# Altium schematic sheet Joysticks.SchDoc
size 149 x 110 mm; SheetNumber: 2; SheetTotal: 2
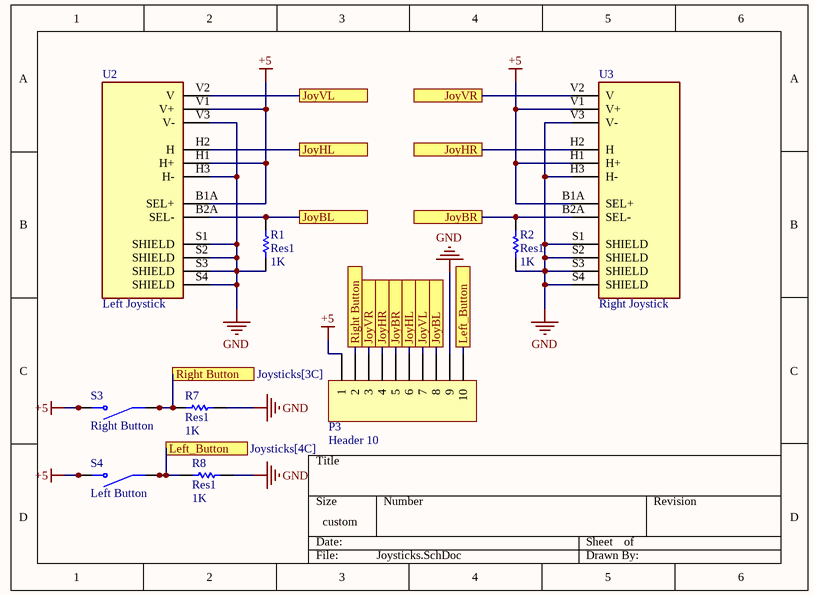
[diagram p0: Joysticks.SchDoc]

## Parts
P3  Header 10  [HDR1X10]
R1  Res1  value 1K  [AXIAL-0.3]
R2  Res1  value 1K  [AXIAL-0.3]
R7  Res1  value 1K  [AXIAL-0.3]
R8  Res1  value 1K  [AXIAL-0.3]
S3  Right Button  [SW_B3F-4055]
S4  Left Button  [SW_B3F-4055]
U2  Left Joystick  [XDCR_COM-09032]
U3  Right Joystick  [XDCR_COM-09032]

## Ports
JoyBL (see Joysticks[3B], Sheet1[3A]), JoyBL (see Joysticks[4C], Sheet1[3A]), JoyBR (see Joysticks[3C], Sheet1[3A]), JoyBR (see Joysticks[4B], Sheet1[3A]), JoyHL (see Joysticks[3A], Sheet1[3A]), JoyHL (see Joysticks[3C], Sheet1[3A]), JoyHR (see Joysticks[3C], Sheet1[3A]), JoyHR (see Joysticks[4A], Sheet1[3A]), JoyVL (see Joysticks[3A], Sheet1[3A]), JoyVL (see Joysticks[4C], Sheet1[3A]), JoyVR (see Joysticks[3C], Sheet1[3A]), JoyVR (see Joysticks[4A], Sheet1[3A]), Left_Button (see Joysticks[2D]), Left_Button (see Joysticks[4C]), Right Button (see Joysticks[2C]), Right Button (see Joysticks[3C])

## Nets
+5: P3.1 S3.3(NO) S3.4(NO) S4.3(NO) S4.4(NO) U2.B1A(SEL+) U2.H1(H+) U2.V1(V+) U3.B1A(SEL+) U3.H1(H+) U3.V1(V+)
GND: P3.9 R1.1 R2.1 R7.1 R8.1 U2.H3(H-) U2.S1(SHIELD) U2.S2(SHIELD) U2.S3(SHIELD) U2.S4(SHIELD) U2.V3(V-) U3.H3(H-) U3.S1(SHIELD) U3.S2(SHIELD) U3.S3(SHIELD) U3.S4(SHIELD) U3.V3(V-)
JoyBL: P3.8 R1.2 U2.B2A(SEL-) ; port JoyBL
JoyBR: P3.5 R2.2 U3.B2A(SEL-) ; port JoyBR
JoyHL: P3.6 U2.H2(H) ; port JoyHL
JoyHR: P3.4 U3.H2(H) ; port JoyHR
JoyVL: P3.7 U2.V2(V) ; port JoyVL
JoyVR: P3.3 U3.V2(V) ; port JoyVR
Left_Button: P3.10 R8.2 S4.1(COM) S4.2(COM) ; port Left_Button
Right Button: P3.2 R7.2 S3.1(COM) S3.2(COM) ; port Right Button

## Library data of the parts
P3 = Header 10: Header, 10-Pin; LatestRevisionDate: 17-Jul-2002; LatestRevisionNote: Re-released for DXP Platform.; Publisher: Altium Limited
R1 R2 R7 R8 = Res1: Resistor; Published: 8-Jun-2000; LatestRevisionDate: 17-Jul-2002; LatestRevisionNote: Re-released for DXP Platform.; PackageReference: AXIAL-0.3; Publisher: Altium Limited; PackageDescription: Axial Device, Thru-Hole; 2 Leads; 0.3 in Pin Spacing
S3 S4 = B3F-4055: Price: None; MP: B3F-4055; Availability: Unavailable; Value: *; Package: None
U2 U3 = COM-09032: Thumb Joystick; Price: None; Availability: Unavailable; MP: COM-09032; Value: *; Package: None